# EAGLE design display (EAGLE 9.4.2)
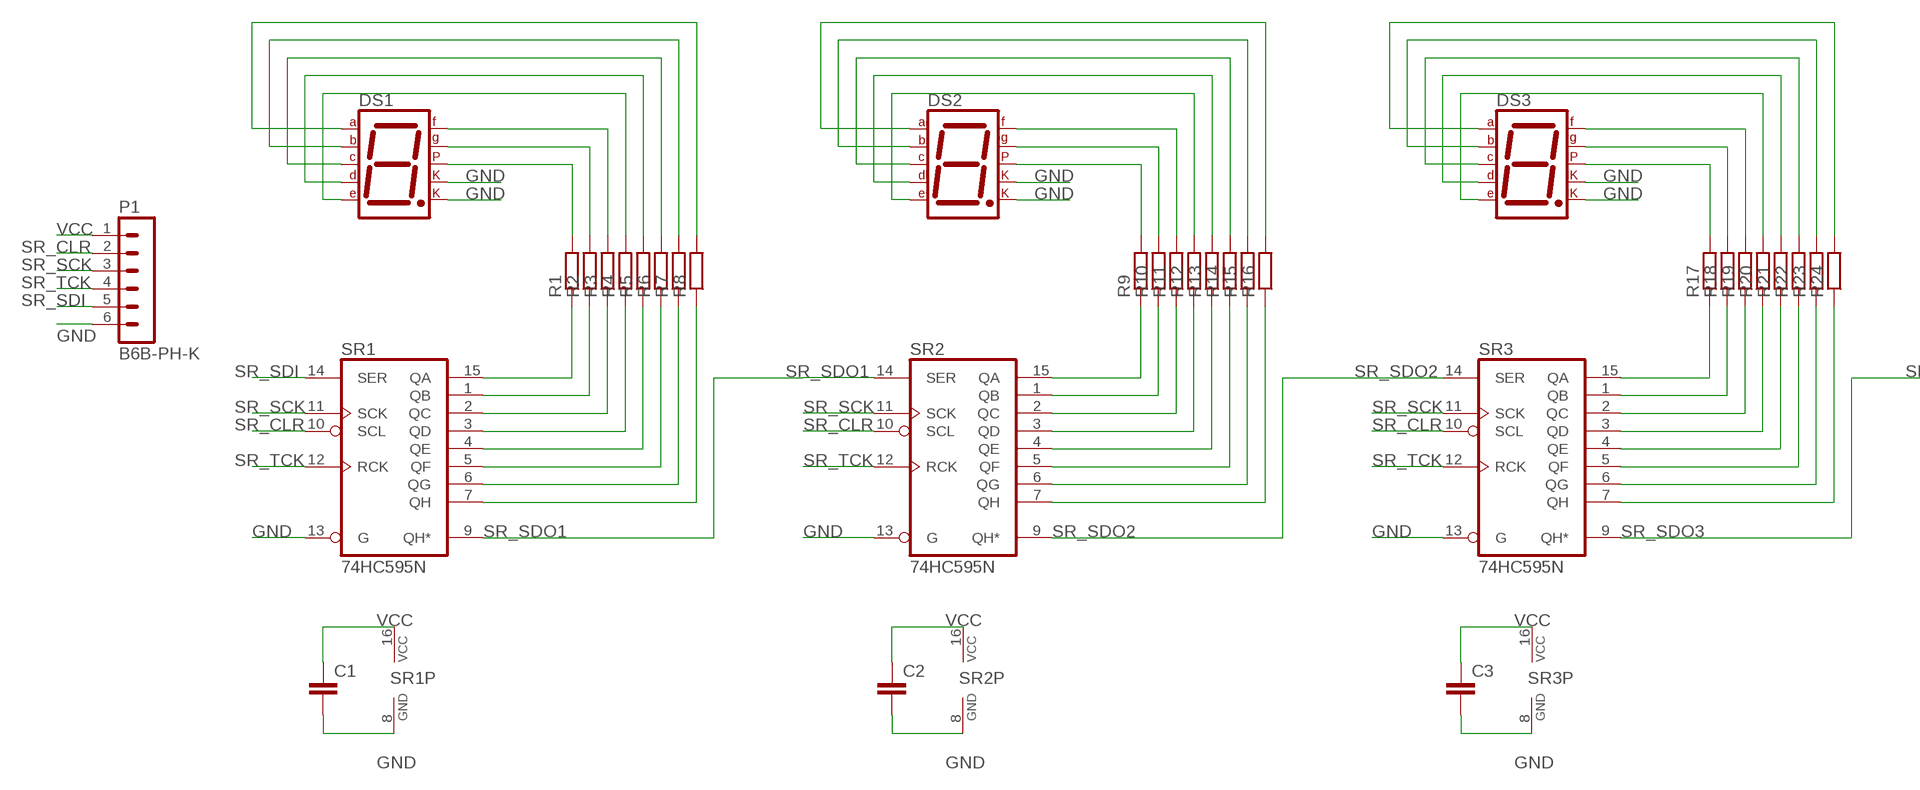
[diagram p0: schematic, sheet 1, part 1 of 2]
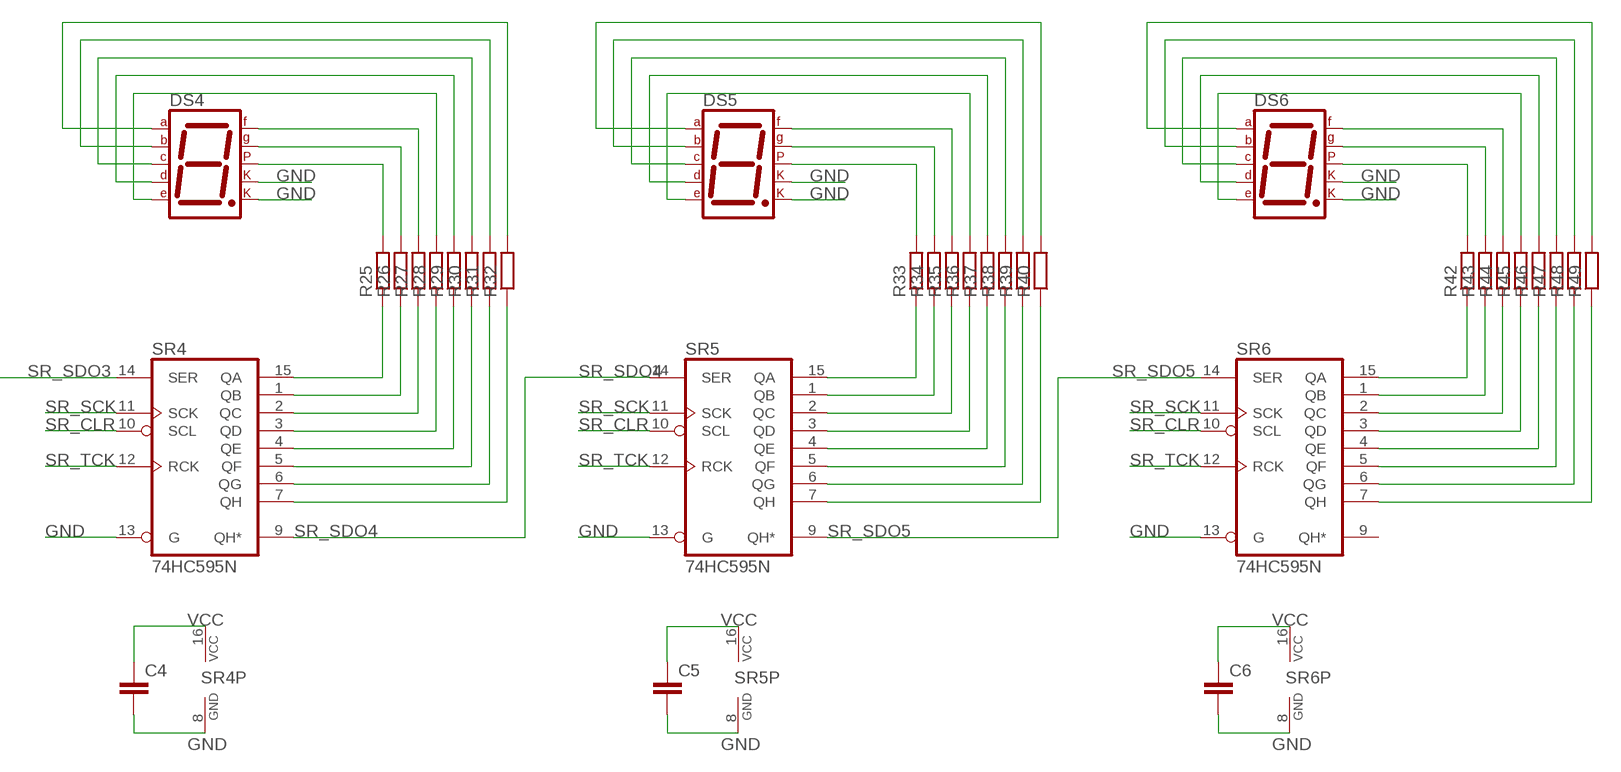
[diagram p1: schematic, sheet 1, part 2 of 2]

## Parts
C1  C-EU025-024X044  [C025-024X044]
C2  C-EU025-024X044  [C025-024X044]
C3  C-EU025-024X044  [C025-024X044]
C4  C-EU025-024X044  [C025-024X044]
C5  C-EU025-024X044  [C025-024X044]
C6  C-EU025-024X044  [C025-024X044]
DS1  7SEG-CK  [7SEG-13]
DS2  7SEG-CK  [7SEG-13]
DS3  7SEG-CK  [7SEG-13]
DS4  7SEG-CK  [7SEG-13]
DS5  7SEG-CK  [7SEG-13]
DS6  7SEG-CK  [7SEG-13]
P1  B6B-PH-K  [B6B-PH-K]
R1  R-EU_0207/10  [0207/10]
R2  R-EU_0207/10  [0207/10]
R3  R-EU_0207/10  [0207/10]
R4  R-EU_0207/10  [0207/10]
R5  R-EU_0207/10  [0207/10]
R6  R-EU_0207/10  [0207/10]
R7  R-EU_0207/10  [0207/10]
R8  R-EU_0207/10  [0207/10]
R9  R-EU_0207/10  [0207/10]
R10  R-EU_0207/10  [0207/10]
R11  R-EU_0207/10  [0207/10]
R12  R-EU_0207/10  [0207/10]
R13  R-EU_0207/10  [0207/10]
R14  R-EU_0207/10  [0207/10]
R15  R-EU_0207/10  [0207/10]
R16  R-EU_0207/10  [0207/10]
R17  R-EU_0207/10  [0207/10]
R18  R-EU_0207/10  [0207/10]
R19  R-EU_0207/10  [0207/10]
R20  R-EU_0207/10  [0207/10]
R21  R-EU_0207/10  [0207/10]
R22  R-EU_0207/10  [0207/10]
R23  R-EU_0207/10  [0207/10]
R24  R-EU_0207/10  [0207/10]
R25  R-EU_0207/10  [0207/10]
R26  R-EU_0207/10  [0207/10]
R27  R-EU_0207/10  [0207/10]
R28  R-EU_0207/10  [0207/10]
R29  R-EU_0207/10  [0207/10]
R30  R-EU_0207/10  [0207/10]
R31  R-EU_0207/10  [0207/10]
R32  R-EU_0207/10  [0207/10]
R33  R-EU_0207/10  [0207/10]
R34  R-EU_0207/10  [0207/10]
R35  R-EU_0207/10  [0207/10]
R36  R-EU_0207/10  [0207/10]
R37  R-EU_0207/10  [0207/10]
R38  R-EU_0207/10  [0207/10]
R39  R-EU_0207/10  [0207/10]
R40  R-EU_0207/10  [0207/10]
R42  R-EU_0207/10  [0207/10]
R43  R-EU_0207/10  [0207/10]
R44  R-EU_0207/10  [0207/10]
R45  R-EU_0207/10  [0207/10]
R46  R-EU_0207/10  [0207/10]
R47  R-EU_0207/10  [0207/10]
R48  R-EU_0207/10  [0207/10]
R49  R-EU_0207/10  [0207/10]
SR1  74HC595N  [DIL16]
SR2  74HC595N  [DIL16]
SR3  74HC595N  [DIL16]
SR4  74HC595N  [DIL16]
SR5  74HC595N  [DIL16]
SR6  74HC595N  [DIL16]

## Nets
GND: C1.2 C2.2 C3.2 C4.2 C5.2 C6.2 DS1.3(CK1) DS1.8(CK2) DS2.3(CK1) DS2.8(CK2) DS3.3(CK1) DS3.8(CK2) DS4.3(CK1) DS4.8(CK2) DS5.3(CK1) DS5.8(CK2) DS6.3(CK1) DS6.8(CK2) P1.6 SR1.8(GND) SR1.13(G) SR2.8(GND) SR2.13(G) SR3.8(GND) SR3.13(G) SR4.8(GND) SR4.13(G) SR5.8(GND) SR5.13(G) SR6.8(GND) SR6.13(G)
N$13: R1.1 SR1.15(QA)
N$14: R2.1 SR1.1(QB)
N$15: R3.1 SR1.2(QC)
N$16: R4.1 SR1.3(QD)
N$17: R5.1 SR1.4(QE)
N$18: R6.1 SR1.5(QF)
N$19: R7.1 SR1.6(QG)
N$20: R8.1 SR1.7(QH)
N$21: R9.1 SR2.15(QA)
N$22: R10.1 SR2.1(QB)
N$23: R11.1 SR2.2(QC)
N$24: R12.1 SR2.3(QD)
N$25: R13.1 SR2.4(QE)
N$26: R14.1 SR2.5(QF)
N$27: R15.1 SR2.6(QG)
N$28: R16.1 SR2.7(QH)
N$29: R17.1 SR3.15(QA)
N$30: R18.1 SR3.1(QB)
N$31: R19.1 SR3.2(QC)
N$32: R20.1 SR3.3(QD)
N$33: R21.1 SR3.4(QE)
N$34: R22.1 SR3.5(QF)
N$35: R23.1 SR3.6(QG)
N$36: R24.1 SR3.7(QH)
N$37: R25.1 SR4.15(QA)
N$38: R26.1 SR4.1(QB)
N$39: R27.1 SR4.2(QC)
N$40: R28.1 SR4.3(QD)
N$41: R29.1 SR4.4(QE)
N$42: R30.1 SR4.5(QF)
N$43: R31.1 SR4.6(QG)
N$44: R32.1 SR4.7(QH)
N$45: R33.1 SR5.15(QA)
N$46: R34.1 SR5.1(QB)
N$47: R35.1 SR5.2(QC)
N$48: R36.1 SR5.3(QD)
N$49: R37.1 SR5.4(QE)
N$50: R38.1 SR5.5(QF)
N$51: R39.1 SR5.6(QG)
N$52: R40.1 SR5.7(QH)
N$53: R42.1 SR6.15(QA)
N$54: R43.1 SR6.1(QB)
N$55: R44.1 SR6.2(QC)
N$56: R45.1 SR6.3(QD)
N$57: R46.1 SR6.4(QE)
N$58: R47.1 SR6.5(QF)
N$59: R48.1 SR6.6(QG)
N$60: R49.1 SR6.7(QH)
N$61: DS1.5(DP) R1.2
N$62: DS1.10(G) R2.2
N$63: DS1.9(F) R3.2
N$64: DS1.1(E) R4.2
N$65: DS1.2(D) R5.2
N$66: DS1.4(C) R6.2
N$67: DS1.6(B) R7.2
N$68: DS1.7(A) R8.2
N$69: DS2.5(DP) R9.2
N$70: DS2.10(G) R10.2
N$71: DS2.9(F) R11.2
N$72: DS2.1(E) R12.2
N$73: DS2.2(D) R13.2
N$74: DS2.4(C) R14.2
N$75: DS2.6(B) R15.2
N$76: DS2.7(A) R16.2
N$77: DS3.5(DP) R17.2
N$78: DS3.10(G) R18.2
N$79: DS3.9(F) R19.2
N$80: DS3.1(E) R20.2
N$81: DS3.2(D) R21.2
N$82: DS3.4(C) R22.2
N$83: DS3.6(B) R23.2
N$84: DS3.7(A) R24.2
N$85: DS4.5(DP) R25.2
N$86: DS4.10(G) R26.2
N$87: DS4.9(F) R27.2
N$88: DS4.1(E) R28.2
N$89: DS4.2(D) R29.2
N$90: DS4.4(C) R30.2
N$91: DS4.6(B) R31.2
N$92: DS4.7(A) R32.2
N$93: DS5.5(DP) R33.2
N$94: DS5.10(G) R34.2
N$95: DS5.9(F) R35.2
N$96: DS5.1(E) R36.2
N$97: DS5.2(D) R37.2
N$98: DS5.4(C) R38.2
N$99: DS5.6(B) R39.2
N$100: DS5.7(A) R40.2
N$101: DS6.5(DP) R42.2
N$102: DS6.10(G) R43.2
N$103: DS6.9(F) R44.2
N$104: DS6.1(E) R45.2
N$105: DS6.2(D) R46.2
N$106: DS6.4(C) R47.2
N$107: DS6.6(B) R48.2
N$108: DS6.7(A) R49.2
SR_CLR: P1.2 SR1.10(SCL) SR2.10(SCL) SR3.10(SCL) SR4.10(SCL) SR5.10(SCL) SR6.10(SCL)
SR_SCK: P1.3 SR1.11(SCK) SR2.11(SCK) SR3.11(SCK) SR4.11(SCK) SR5.11(SCK) SR6.11(SCK)
SR_SDI: P1.5 SR1.14(SER)
SR_SDO1: SR1.9(QH*) SR2.14(SER)
SR_SDO2: SR2.9(QH*) SR3.14(SER)
SR_SDO3: SR3.9(QH*) SR4.14(SER)
SR_SDO4: SR4.9(QH*) SR5.14(SER)
SR_SDO5: SR5.9(QH*) SR6.14(SER)
SR_TCK: P1.4 SR1.12(RCK) SR2.12(RCK) SR3.12(RCK) SR4.12(RCK) SR5.12(RCK) SR6.12(RCK)
VCC: C1.1 C2.1 C3.1 C4.1 C5.1 C6.1 P1.1 SR1.16(VCC) SR2.16(VCC) SR3.16(VCC) SR4.16(VCC) SR5.16(VCC) SR6.16(VCC)
Unconnected: SR6.9(QH*)

## Library data of the parts
C1-C6 = rcl:C-EU: CAPACITOR, European symbol; SPICEPREFIX: C
DS1-DS6 = special:7SEG-CK: 7-segment DISPLAY single cathode, 13 mm
P1 = con-jst-ph:B6B-PH-K: HEADER
R1-R40 R42-R49 = rcl:R-EU_: RESISTOR, European symbol; SPICEPREFIX: R
SR1-SR6 = 74xx-eu:74*595: 8-bit SHIFT REGISTER, output latch

## Board
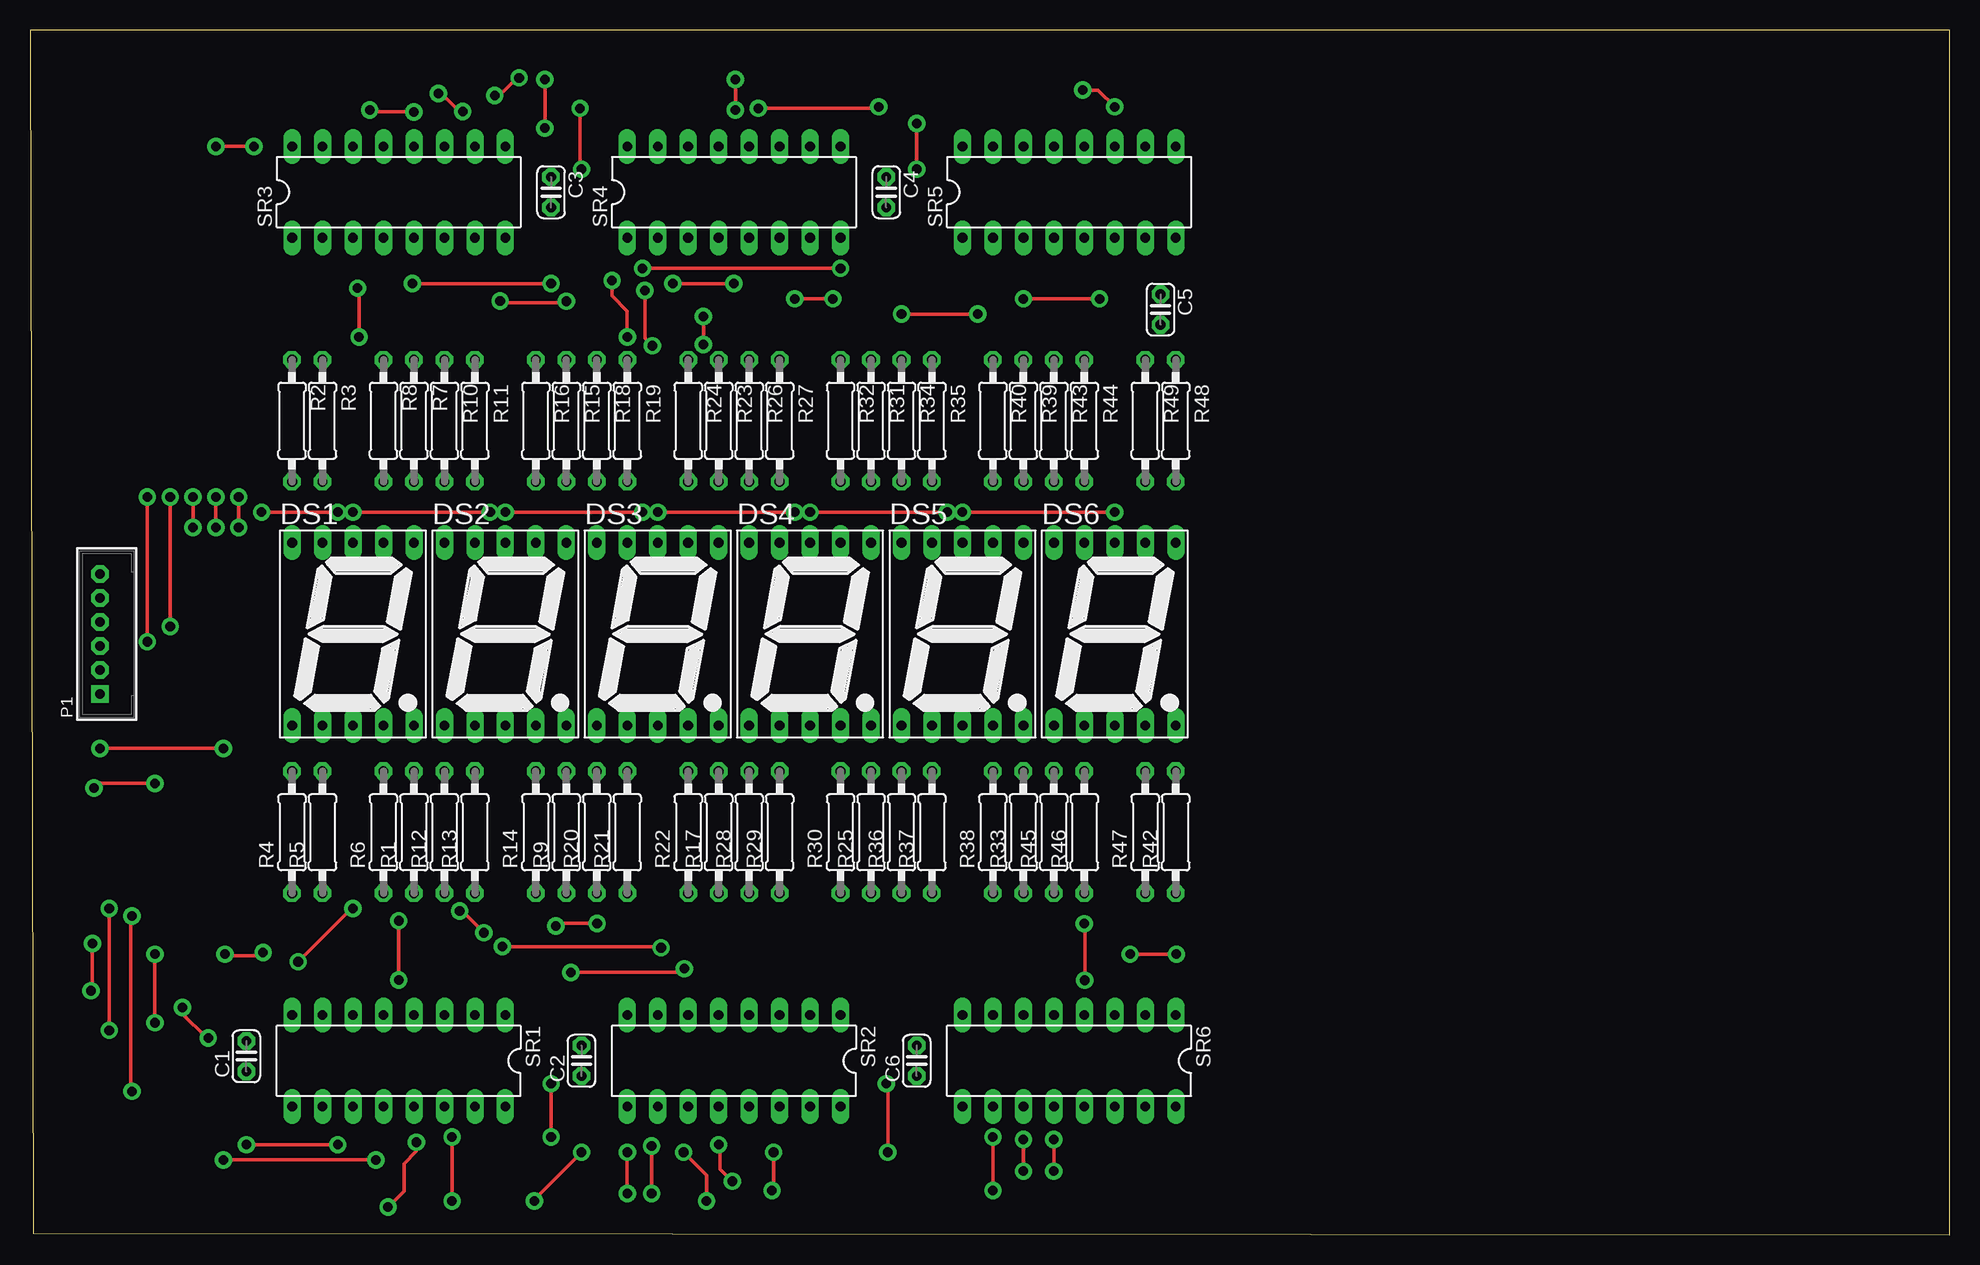
[diagram p2: board, top side]
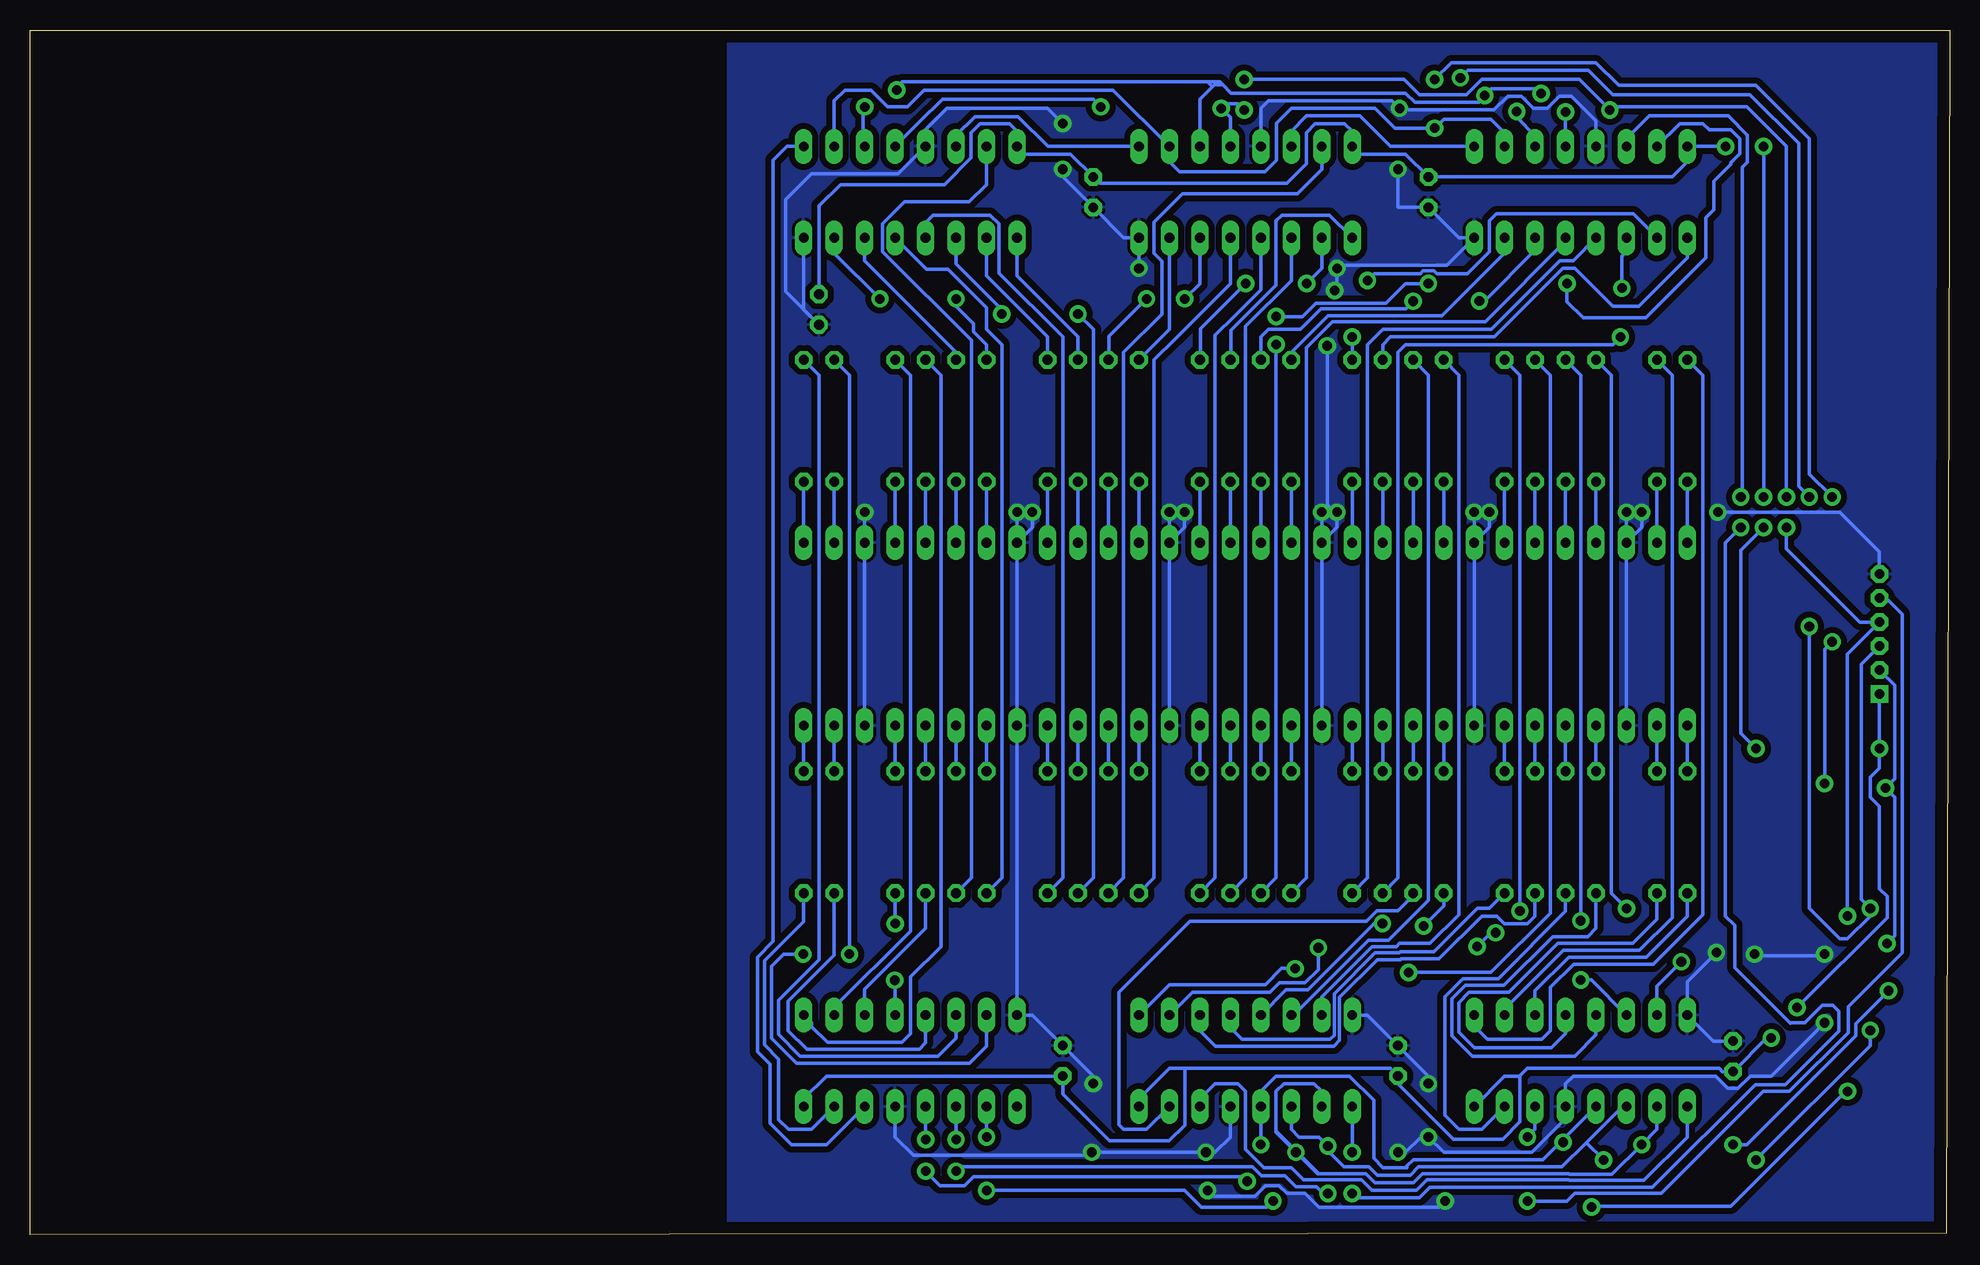
[diagram p3: board, bottom side, seen from below]

Size 160 x 100.38 mm. Coordinates in mm from the lower left corner, seen from the top.
Outline: 0.25,0.13 160,0 160,100.38 0,100.38 0.25,0.13
Copper layers (1*16): Top 0.035mm / dielectric 1.5mm / Bottom 0.035mm
Design rules "default *": minimum track width 6mil, minimum drill 0.65mm, track to track 0.15mm, track to pad 6mil, pad to pad 6mil, via to via 6mil, smd to smd 6mil, copper to edge 40mil, drill to drill 6mil, minimum pad ring 10mil, minimum via ring 8mil, stop-mask expansion 4mil, vias tented up to drill 0mil, thermal gap 10mil

### Footprints (pad centres in the part's own frame; a part is rotated, then mirrored left to right if it is on the bottom)
C025-024X044 = drill 0.813 octagon: 1 -1.27,0; 2 1.27,0
7SEG-13 = drill 0.813 long: 1 -5.08,-7.62; 2 -2.54,-7.62; 3 0,-7.62; 4 2.54,-7.62; 5 5.08,-7.62; 6 5.08,7.62; 7 2.54,7.62; 8 0,7.62; 9 -2.54,7.62; 10 -5.08,7.62
B6B-PH-K = drill 0.813 square: 1 -5,0 | drill 0.813 octagon: 2 -3,0; 3 -1,0; 4 1,0; 5 3,0; 6 5,0
0207/10 = drill 0.813 octagon: 1 -5.08,0; 2 5.08,0
DIL16 = drill 0.813 long: 1 -8.89,-3.81; 2 -6.35,-3.81; 3 -3.81,-3.81; 4 -1.27,-3.81; 5 1.27,-3.81; 6 3.81,-3.81; 7 6.35,-3.81; 8 8.89,-3.81; 9 8.89,3.81; 10 6.35,3.81; 11 3.81,3.81; 12 1.27,3.81; 13 -1.27,3.81; 14 -3.81,3.81; 15 -6.35,3.81; 16 -8.89,3.81

### Placement (x,y rotation side)
C1  18.03,14.86 90 top
C2  45.97,14.48 90 top
C3  43.43,86.87 270 top
C4  71.37,86.87 270 top
C5  94.23,77.09 270 top
C6  73.91,14.48 90 top
DS1  26.92,50.04 0 top
DS2  39.62,50.04 0 top
DS3  52.32,50.04 0 top
DS4  65.02,50.04 0 top
DS5  77.72,50.04 0 top
DS6  90.42,50.04 0 top
P1  5.84,50.04 90 top
R1  32,33.53 90 top
R2  21.84,67.82 270 top
R3  24.38,67.82 270 top
R4  21.84,33.53 90 top
R5  24.38,33.53 90 top
R6  29.46,33.53 90 top
R7  32,67.82 270 top
R8  29.46,67.82 270 top
R9  44.7,33.53 90 top
R10  34.54,67.82 270 top
R11  37.08,67.82 270 top
R12  34.54,33.53 90 top
R13  37.08,33.53 90 top
R14  42.16,33.53 90 top
R15  44.7,67.82 270 top
R16  42.16,67.82 270 top
R17  57.4,33.53 90 top
R18  47.24,67.82 270 top
R19  49.78,67.82 270 top
R20  47.24,33.53 90 top
R21  49.78,33.53 90 top
R22  54.86,33.53 90 top
R23  57.4,67.82 270 top
R24  54.86,67.82 270 top
R25  70.1,33.53 90 top
R26  59.94,67.82 270 top
R27  62.48,67.82 270 top
R28  59.94,33.53 90 top
R29  62.48,33.53 90 top
R30  67.56,33.53 90 top
R31  70.1,67.82 270 top
R32  67.56,67.82 270 top
R33  82.8,33.53 90 top
R34  72.64,67.82 270 top
R35  75.18,67.82 270 top
R36  72.64,33.53 90 top
R37  75.18,33.53 90 top
R38  80.26,33.53 90 top
R39  82.8,67.82 270 top
R40  80.26,67.82 270 top
R42  95.5,33.53 90 top
R43  85.34,67.82 270 top
R44  87.88,67.82 270 top
R45  85.34,33.53 90 top
R46  87.88,33.53 90 top
R47  92.96,33.53 90 top
R48  95.5,67.82 270 top
R49  92.96,67.82 270 top
SR1  30.73,14.48 180 top
SR2  58.67,14.48 180 top
SR3  30.73,86.87 0 top
SR4  58.67,86.87 0 top
SR5  86.61,86.87 0 top
SR6  86.61,14.48 180 top

### Tracks (layer width: path | path; a pad name or v marks a point on that pad's centre or on a via)
GND  (via drill 0.8)
  Top 0.3: v19.3,60.2 v25.65,60.2 | v26.92,60.2 v38.35,60.2 | v39.62,60.2 v51.05,60.2 | v52.32,60.2 v63.75,60.2 | v65.02,60.2 v76.45,60.2 | v77.72,60.2 v90.42,60.2 | v43.43,12.57 v43.43,8.13 | v71.37,12.57 71.5,12.45 v71.5,6.86 | v45.97,88.77 45.85,88.9 v45.85,93.85 | v73.91,88.77 v73.91,92.58 | v61.98,6.86 61.98,3.81 v61.85,3.68 | v42.04,2.79 42.04,2.92 v45.97,6.86 | v10.41,17.65 v10.41,23.37 | v19.43,23.5 19.18,23.24 16.38,23.24 v16.26,23.37 | v51.05,80.52 v67.56,80.52 | v51.26,78.68 51.26,74.68 v51.87,74.07
  Bottom 0.3: DS6.3 DS6.8 v90.42,60.2 | DS5.8 DS5.3 SR6.8 76.45,18.29 C6.2 71.37,13.21 v71.37,12.57 | DS4.8 DS4.3 | DS3.8 DS3.3 | DS2.8 DS2.3 | DS1.8 DS1.3 | P1.6 5.84,56.9 9.14,60.2 v19.3,60.2 | DS1.8 25.65,58.93 v25.65,60.2 v26.92,60.2 DS1.8 | DS2.8 38.35,58.93 v38.35,60.2 v39.62,60.2 DS2.8 | DS3.8 51.05,58.93 v51.05,60.2 51.26,60.2 | DS3.8 v52.32,60.2 51.26,60.2 | DS4.8 63.75,58.93 v63.75,60.2 v65.02,60.2 DS4.8 | DS5.8 76.45,58.93 v76.45,60.2 v77.72,60.2 DS5.8 | C1.2 19.68,16.13 SR1.8 21.84,21.08 v19.43,23.5 | SR2.8 48.51,18.29 C2.2 43.43,13.21 v43.43,12.57 | SR5.8 95.5,77.09 C5.2 97.03,78.61 97.03,86.23 94.87,88.39 87.63,88.39 SR5.13 85.34,92.08 83.57,93.85 75.18,93.85 v73.91,92.58 | SR2.13 59.94,8.13 61.21,6.86 v61.98,6.86 v71.5,6.86 71.75,6.6 86.36,6.6 87.88,8.13 SR6.13 | v45.97,88.77 45.97,85.6 C3.2 40.89,83.06 SR3.8 41.92,80.77 50.81,80.77 v51.05,80.52 51.05,78.89 v51.26,78.68 | SR4.13 57.4,93.85 56.77,94.49 46.48,94.49 v45.85,93.85 45.72,93.73 37.97,93.73 36.83,94.87 35.69,94.87 34.67,93.85 33.53,93.85 32.51,94.87 31.51,94.87 29.46,92.82 SR3.13 | v73.91,88.77 73.91,88.14 C4.2 68.83,83.06 SR4.8 v67.56,80.52 | v61.85,3.68 61.34,3.17 57.91,3.17 57.02,4.06 55.88,4.06 55.24,3.43 53.72,3.43 52.58,2.29 42.55,2.29 v42.04,2.79 | v45.97,6.86 45.34,6.86 44.07,8.13 v43.43,8.13 42.16,6.86 34.8,6.86 32,9.65 SR1.13 32,12.57 31.37,13.21 19.5,13.21 18.46,12.17 17.65,12.17 16.62,13.21 14.86,13.21 v10.41,17.65 | v10.41,23.37 10.54,23.24 16.13,23.24 v16.26,23.37 | v51.87,74.07 51.87,60.81 51.26,60.2
  pour Bottom (isolate 0.5): 0.13,100.33 0.13,0.25 101.85,0.25 101.85,100.33
N$13
  Bottom 0.3: R1.1 32,26.93 37.6,21.33 40.55,21.33 42.07,19.82 42.07,9.94 40.89,8.76 38.99,8.76 SR1.15
N$14
  Bottom 0.3: R2.1 20.57,71.63 20.57,26.67 24.71,22.54 31.31,22.54 33.26,20.59 33.26,17 33.99,16.27 38.53,16.27 39.62,17.36 SR1.1
N$15
  Bottom 0.3: R3.1 23.11,71.63 23.11,26.42 25.84,23.69 32.19,23.69 37.08,18.8 SR1.2
N$16
  Bottom 0.3: R4.1 21.84,26.54 25.27,23.11 31.75,23.11 34.54,20.32 SR1.3
N$17
  Bottom 0.3: SR1.4 32,16.73 33.17,15.56 39.6,15.56 40.91,16.87 40.91,19.32 40.05,20.18 36.72,20.18 32.64,24.26 26.42,24.26 24.38,26.29 R5.1
N$18
  Bottom 0.3: R6.1 29.46,25.53 30.16,24.83 33.08,24.83 37.16,20.76 40.37,20.76 41.49,19.63 41.49,16.56 39.79,14.86 31.24,14.86 29.46,16.64 SR1.5
N$19  (via drill 0.8)
  Top 0.3: v30.73,21.22 v30.73,26.16
  Bottom 0.3: R7.1 30.73,71.63 v30.73,26.16 | SR1.6 29.85,21.22 v30.73,21.22
N$20  (via drill 0.8)
  Top 0.3: v26.92,27.18 26.8,27.18 v22.35,22.73
  Bottom 0.3: R8.1 28.19,71.63 28.19,28.45 v26.92,27.18 | SR1.7 24.38,20.7 v22.35,22.73
N$21
  Bottom 0.3: R9.1 44.7,28.26 45.97,27 47.71,27 48.59,26.12 63.31,26.12 69.23,20.19 69.23,9.16 68.83,8.76 66.93,8.76 SR2.15
N$22  (via drill 0.8)
  Top 0.3: v54.54,22.16 54.23,21.85 v45.09,21.85
  Bottom 0.3: R10.1 33.27,71.63 33.27,26.8 38.22,21.85 v45.09,21.85 | SR2.1 65.02,20.83 57.03,20.83 55.68,22.18 54.56,22.18 v54.54,22.16
N$23  (via drill 0.8)
  Top 0.3: v52.6,23.9 52.51,24 v39.37,24 | v37.84,25.15 36.02,26.98 v35.81,26.98
  Bottom 0.3: R11.1 35.81,71.63 v35.81,26.98 | SR2.2 63.12,20.19 56.64,20.19 55.87,20.97 53.72,20.97 52.6,22.08 v52.6,23.9 | v39.37,24 38.22,25.15 v37.84,25.15
N$24
  Bottom 0.3: SR2.3 62.48,16.98 61.19,15.69 51.33,15.69 50.84,16.18 50.84,19.77 47.69,22.92 45.79,22.92 45.73,22.98 42.55,22.98 38.99,26.54 37.72,26.54 37.08,25.91 35.18,25.91 34.54,26.54 R12.1
N$25
  Bottom 0.3: SR2.4 59.94,17.24 58.98,16.27 51.64,16.27 51.29,16.62 51.29,20.08 47.88,23.5 45.85,23.5 45.79,23.55 42.99,23.55 39.37,27.18 38.35,27.18 R13.1
N$26  (via drill 0.8)
  Top 0.3: v47.27,25.93 43.84,25.93 v43.84,25.71
  Bottom 0.3: v47.27,25.93 47.92,25.93 53.47,20.39 55.3,20.39 SR2.5 | v43.84,25.71 42.16,27.38 R14.1
N$27
  Bottom 0.3: R15.1 43.43,71.63 43.43,27.88 46.77,24.54 48.42,24.54 54.68,18.29 SR2.6
N$28
  Bottom 0.3: R16.1 40.89,71.63 40.89,26.67 43.31,24.26 45.85,24.26 46.1,24 48.13,24 52.32,19.81 SR2.7
N$29  (via drill 0.8)
  Top 0.3: v56.13,74.17 v56.13,76.5 | v43.43,79.25 v31.88,79.25
  Bottom 0.3: R17.1 56.13,29.72 v56.13,74.17 | v56.13,76.5 53.93,76.5 52.82,77.62 46.97,77.62 45.34,79.25 v43.43,79.25 | v31.88,79.25 31.88,77.72 30.54,76.39 25.31,76.39 20.3,81.39 20.3,84.73 19.63,85.39 19.63,87.78 18.23,89.19 18.23,89.31 17.48,90.06 17.48,91.3 18.23,92.05 20.04,92.05 20.57,92.58 22.48,92.58 SR3.15
N$30
  Bottom 0.3: SR3.1 21.84,81.41 25.91,77.34 28.07,77.34 31.24,80.52 32.22,80.52 37.93,74.81 42.67,74.81 42.67,74.8 46.61,74.8 47.24,74.17 R18.1
N$31  (via drill 0.8)
  Top 0.3: v48.51,79.5 48.51,78.22 49.78,76.95 v49.78,74.8
  Bottom 0.3: SR3.2 24.38,83.09 26.37,85.08 37.77,85.08 38.37,84.47 38.37,81.9 40.21,80.07 42.74,80.07 42.99,80.31 43.88,80.31 44.12,80.07 47.94,80.07 v48.51,79.5 | v49.78,74.8 R19.1
N$32  (via drill 0.8)
  Top 0.3: v27.3,78.87 27.43,78.74 v27.43,74.8
  Bottom 0.3: R20.1 45.97,29.72 45.97,73.53 45.34,74.17 28.07,74.17 v27.43,74.8 | SR3.3 26.92,81.92 27.3,81.53 v27.3,78.87
N$33
  Bottom 0.3: R21.1 48.51,29.72 48.51,74.17 47.24,75.44 38.19,75.44 32.48,81.15 31.37,81.15 SR3.4
N$34
  Bottom 0.3: R22.1 53.59,29.72 53.59,73.91 51.43,76.07 43.31,76.07 43.29,76.09 38.69,76.09 32,82.77 SR3.5
N$35  (via drill 0.8)
  Top 0.3: v39.19,77.8 39.31,77.67 44.6,77.67 v44.7,77.78
  Bottom 0.3: R23.1 57.4,74.8 56.77,75.44 54.1,75.44 52.38,77.17 45.31,77.17 v44.7,77.78 | v39.19,77.8 38.79,77.8 34.54,82.04 SR3.6
N$36
  Bottom 0.3: SR3.7 37.08,81.79 37.27,81.6 42.29,76.58 51.82,76.58 54.86,73.53 R24.1
N$37
  Bottom 0.3: R25.1 68.83,29.72 68.83,73.53 65.66,76.71 65.66,81.12 66.31,81.77 66.31,84.34 63.93,86.73 62.62,86.73 62.61,86.74 54.36,86.74 52.32,88.77 SR4.15
N$38
  Bottom 0.3: R26.1 59.89,72.96 59.89,75.37 56.15,79.1 56.15,84.47 55.66,84.96 51.69,84.96 SR4.1
N$39  (via drill 0.8)
  Top 0.3: v58.67,79.25 v53.59,79.25
  Bottom 0.3: R27.1 62.48,72.94 62.44,72.99 62.44,75.48 v58.67,79.25 | v53.59,79.25 52.32,80.52 SR4.2
N$40
  Bottom 0.3: R28.1 58.67,29.72 58.67,75.69 54.86,79.5 SR4.3
N$41
  Bottom 0.3: R29.1 61.21,29.72 61.21,74.93 59.57,76.57 57.4,78.74 SR4.4
N$42
  Bottom 0.3: R30.1 66.29,29.72 66.29,72.9 64.54,74.65 64.54,74.66 59.94,79.25 SR4.5
N$43  (via drill 0.8)
  Top 0.3: v66.93,77.98 v63.75,77.98
  Bottom 0.3: R31.1 70.05,72.96 70.05,74.86 v66.93,77.98 | v63.75,77.98 62.48,79.25 SR4.6
N$44
  Bottom 0.3: R32.1 65.02,75.44 SR4.7
N$45
  Bottom 0.3: R33.1 81.53,29.72 81.53,74.51 88.92,81.9 88.92,84.22 87.09,86.05 81.72,86.05 80.26,87.5 SR5.15
N$46
  Bottom 0.3: SR5.1 77.72,79.88 72.64,74.8 R34.1
N$47
  Bottom 0.3: SR5.2 80.26,79.88 75.18,74.8 R35.1
N$48  (via drill 0.8)
  Top 0.3: v78.99,76.71 v72.64,76.71
  Bottom 0.3: R36.1 71.37,29.72 71.37,75.44 v72.64,76.71 | SR5.3 82.8,80.9 78.99,77.09 v78.99,76.71
N$49
  Bottom 0.3: R37.1 73.91,29.72 73.91,74.8 79.23,80.12 79.23,84.22 79.97,84.96 84.71,84.96 85.34,84.33 SR5.4
N$50
  Bottom 0.3: R38.1 78.99,29.72 78.99,74.17 80.26,75.44 80.26,77.22 83.48,80.43 85.26,80.43 SR5.5
N$51
  Bottom 0.3: R39.1 82.8,73.53 90.42,81.15 SR5.6
N$52  (via drill 0.8)
  Top 0.3: v89.15,77.98 v82.8,77.98
  Bottom 0.3: SR5.7 92.96,81.79 v89.15,77.98 | R40.1 80.26,74.17 81.35,75.25 81.35,75.89 82.8,77.34 v82.8,77.98
N$53
  Bottom 0.3: R42.1 95.5,26.07 97.21,24.36 97.21,24.37 98.78,22.8 98.78,15.81 97.59,14.62 97.59,9.58 96.77,8.76 94.87,8.76 SR6.15
N$54
  Bottom 0.3: R43.1 84.07,71.63 84.07,24 86.6,21.48 86.6,16.75 87.33,16.02 93.52,16.02 94.83,17.33 94.87,17.65 SR6.1
N$55
  Bottom 0.3: R44.1 86.61,71.63 86.61,25.27 92.96,18.92 SR6.2
N$56
  Bottom 0.3: SR6.3 90.42,20.45 85.34,25.53 R45.1
N$57  (via drill 0.8)
  Top 0.3: v87.92,21.19 87.92,25.88 v87.88,25.91
  Bottom 0.3: SR6.4 87.88,21.16 v87.92,21.19 | v87.88,25.91 R46.1
N$58
  Bottom 0.3: SR6.5 85.34,15.97 85.87,15.44 95.23,15.44 96.79,17 96.79,19.45 92.96,23.28 R47.1
N$59
  Bottom 0.3: R48.1 94.23,71.63 94.23,22.9 97.62,19.51 97.62,16.69 95.8,14.86 84.29,14.86 82.8,16.35 SR6.6
N$60  (via drill 0.8)
  Top 0.3: v95.56,23.37 v91.69,23.37
  Bottom 0.3: R49.1 91.69,71.63 v91.69,23.37 | SR6.7 80.26,15.71 81.69,14.28 96.11,14.28 98.2,16.37 98.2,22.36 97.19,23.37 v95.56,23.37
N$61
  Bottom 0.3: R1.2 DS1.5
N$62
  Bottom 0.3: R2.2 DS1.10
N$63
  Bottom 0.3: R3.2 DS1.9
N$64
  Bottom 0.3: R4.2 DS1.1
N$65
  Bottom 0.3: R5.2 DS1.2
N$66
  Bottom 0.3: R6.2 DS1.4
N$67
  Bottom 0.3: R7.2 DS1.6
N$68
  Bottom 0.3: R8.2 DS1.7
N$69
  Bottom 0.3: R9.2 DS2.5
N$70
  Bottom 0.3: R10.2 DS2.10
N$71
  Bottom 0.3: R11.2 DS2.9
N$72
  Bottom 0.3: R12.2 DS2.1
N$73
  Bottom 0.3: R13.2 DS2.2
N$74
  Bottom 0.3: R14.2 DS2.4
N$75
  Bottom 0.3: R15.2 DS2.6
N$76
  Bottom 0.3: R16.2 DS2.7
N$77
  Bottom 0.3: R17.2 DS3.5
N$78
  Bottom 0.3: R18.2 DS3.10
N$79
  Bottom 0.3: R19.2 DS3.9
N$80
  Bottom 0.3: R20.2 DS3.1
N$81
  Bottom 0.3: R21.2 DS3.2
N$82
  Bottom 0.3: R22.2 DS3.4
N$83
  Bottom 0.3: R23.2 DS3.6
N$84
  Bottom 0.3: R24.2 DS3.7
N$85
  Bottom 0.3: R25.2 DS4.5
N$86
  Bottom 0.3: R26.2 DS4.10
N$87
  Bottom 0.3: R27.2 DS4.9
N$88
  Bottom 0.3: R28.2 DS4.1
N$89
  Bottom 0.3: R29.2 DS4.2
N$90
  Bottom 0.3: R30.2 DS4.4
N$91
  Bottom 0.3: R31.2 DS4.6
N$92
  Bottom 0.3: R32.2 DS4.7
N$93
  Bottom 0.3: R33.2 DS5.5
N$94
  Bottom 0.3: R34.2 DS5.10
N$95
  Bottom 0.3: R35.2 DS5.9
N$96
  Bottom 0.3: R36.2 DS5.1
N$97
  Bottom 0.3: R37.2 DS5.2
N$98
  Bottom 0.3: R38.2 DS5.4
N$99
  Bottom 0.3: R39.2 DS5.6
N$100
  Bottom 0.3: R40.2 DS5.7
N$101
  Bottom 0.3: R42.2 DS6.5
N$102
  Bottom 0.3: R43.2 DS6.10
N$103
  Bottom 0.3: R44.2 DS6.9
N$104
  Bottom 0.3: R45.2 DS6.1
N$105
  Bottom 0.3: R46.2 DS6.2
N$106
  Bottom 0.3: R47.2 DS6.4
N$107
  Bottom 0.3: R48.2 DS6.6
N$108
  Bottom 0.3: R49.2 DS6.7
SR_CLR  (via drill 0.8)
  Top 0.3: v25.65,7.49 v18.03,7.49 | v5.21,24.26 5.21,20.45 v5.08,20.32 | v80.26,3.68 v80.26,8.13 | v42.93,96.27 v42.93,92.2 | v9.78,61.47 v9.78,49.4 | v10.41,37.59 5.71,37.59 v5.33,37.21 | v54.48,6.86 56.39,4.95 v56.39,2.79
  Bottom 0.3: SR3.10 37.08,91.82 38.23,92.96 42.16,92.96 v42.93,92.2 46.23,92.2 47.88,93.85 54.86,93.85 56.12,92.6 56.12,89.52 57.05,88.59 64.2,88.59 65.02,89.41 SR4.10 69.72,95.38 85.47,95.38 86.87,93.98 88.52,93.98 89.92,95.38 92.08,95.38 92.96,94.49 SR5.10 | SR1.10 24.38,8.76 v25.65,7.49 28.13,5.02 31.69,5.02 31.75,5.08 43.94,5.08 44.7,4.32 47.88,4.32 48.64,5.08 52.58,5.08 | 52.58,5.08 56.13,8.64 | 56.13,8.64 56.13,11.94 55.5,12.57 52.96,12.57 52.32,11.94 SR2.10 | v5.21,24.26 4.57,24.89 4.57,36.45 v5.33,37.21 4.57,37.97 4.57,45.77 P1.2 | v18.03,7.49 16.9,7.49 7.81,16.58 7.81,17.59 v5.08,20.32 | v56.39,2.79 56.9,2.29 62.36,2.29 63.75,3.68 v80.26,3.68 | v80.26,8.13 SR6.10 | v42.93,96.27 41.53,97.66 29.46,97.66 27.56,95.76 16.13,95.76 11.68,91.31 11.68,63.37 v9.78,61.47 | v9.78,49.4 10.41,48.77 v10.41,37.59 | 56.13,8.64 56.13,8.51 v54.48,6.86 52.7,5.08 52.58,5.08
SR_SCK  (via drill 0.8)
  Top 0.3: v36.07,93.6 35.79,93.6 34.29,95.1 v34.04,95.1 | v90.42,93.98 89.03,95.38 v87.76,95.38 | v28.83,6.22 v16.13,6.22 | v6.6,17.02 v6.6,27.18 | v51.81,7.37 51.81,3.44 v51.82,3.43 | v82.8,5.28 v82.8,7.92 | v40.77,96.39 40.59,96.39 39.12,94.92 v38.73,94.92 | v11.68,61.47 v11.68,50.67
  Bottom 0.3: SR3.11 34.54,91.57 36.07,93.09 v36.07,93.6 | v34.04,95.1 34.42,95.48 38.18,95.48 v38.73,94.92 38.73,94.87 39.24,94.36 44.58,94.36 45.34,95.12 59.88,95.12 60.58,95.82 | 60.58,95.82 61.28,95.82 | 61.02,96.08 61.28,95.82 | 61.28,95.82 61.47,95.63 | 61.47,95.63 62.48,94.61 SR4.11 | v87.76,95.38 87.76,95.63 87.31,96.08 61.85,96.08 | 61.85,96.08 61.02,96.08 | v90.42,93.98 90.55,93.85 90.55,90.81 SR5.11 | SR1.11 27.27,10.67 30.27,7.67 | SR2.11 54.86,8.76 54.23,8.13 52.56,8.13 v51.81,7.37 51.81,6.99 50.46,5.65 48.39,5.65 47.69,4.95 44.96,4.95 44.28,5.63 32.3,5.63 30.27,7.67 | 30.27,7.67 v28.83,6.22 | v16.13,6.22 6.6,15.75 v6.6,17.02 | P1.3 7.37,47.51 7.37,27.94 v6.6,27.18 6.6,26.54 8.51,24.64 9.14,24.64 11.68,27.18 v11.68,50.67 | v51.82,3.43 52.2,3.43 52.76,4 54.48,4 55.38,4.89 57.34,4.89 58.12,5.66 82.42,5.66 v82.8,5.28 | v82.8,7.92 SR6.11 | v11.68,61.47 12.57,62.36 12.57,90.93 16.64,95 28.07,95 30.1,97.03 40.13,97.03 v40.77,96.39 | 61.02,96.08 60.83,96.08 60.58,95.82 | 61.47,95.63 61.47,95.69 61.85,96.08
SR_SDI  (via drill 0.8)
  Top 0.3: v35.18,8.13 v35.18,2.79
  Bottom 0.3: SR1.14 34.54,8.76 v35.18,8.13 | v35.18,2.79 31.88,2.79 31.24,3.43 24,3.43 15.51,11.93 13.36,11.93 8.45,16.83 8.45,18.98 3.94,23.5 3.94,51.69 5.29,53.04 P1.5
SR_SDO1
  Bottom 0.3: SR1.9 21.84,8.13 25.46,4.51 31.69,4.51 31.74,4.57 43.56,4.57 44.45,3.68 48.13,3.68 49.02,4.57 53.85,4.57 54.86,5.59 57.15,5.59 58.67,7.11 58.67,11.94 59.31,12.57 61.21,12.57 62.48,11.3 SR2.14
SR_SDO2  (via drill 0.8)
  Top 0.3: v49.78,6.86 v49.78,3.43 | v17.4,58.93 v17.4,61.47
  Bottom 0.3: SR2.9 v49.78,6.86 | v49.78,3.43 49.4,3.05 44.2,3.05 43.31,3.94 24.77,3.94 16.2,12.5 13.67,12.5 9.22,16.96 9.22,18.6 9.72,19.1 10.6,19.1 12.06,17.65 13.21,17.65 13.27,17.59 17.91,22.23 17.91,25.78 18.67,26.54 18.67,57.66 v17.4,58.93 | SR3.14 26.92,91.31 25.02,93.22 18.45,93.22 16.85,91.61 16.85,89.36 17.27,88.94 17.27,61.59 v17.4,61.47
SR_SDO3
  Bottom 0.3: SR3.9 46.61,90.68 49.15,93.22 53.59,93.22 54.86,91.95 SR4.14
SR_SDO4
  Bottom 0.3: SR4.9 75.15,90.68 77.63,93.16 81.25,93.16 82.8,91.6 SR5.14
SR_SDO5
  Bottom 0.3: SR6.14 93.6,7.49 96.52,7.49 98.3,9.27 98.3,14.18 99.35,15.24 99.35,23.11 98.04,24.42 98.04,89.53 96.9,90.68 SR5.9
SR_TCK  (via drill 0.8)
  Top 0.3: v70.74,93.98 70.61,93.85 v60.71,93.85 | v32.2,7.69 32.2,6.93 31.19,5.91 31.19,3.63 v29.84,2.29 | v8.51,11.94 8.38,12.06 8.38,26.42 v8.51,26.54 | v57.4,7.49 57.53,7.37 57.53,5.46 v58.55,4.45 | v85.34,5.28 v85.34,7.92 | v32,93.55 28.5,93.55 v28.32,93.73 | v13.59,61.47 v13.59,58.93 | v58.8,96.27 v58.8,93.73
  Bottom 0.3: SR5.12 85.79,92.77 83.95,94.61 71.37,94.61 v70.74,93.98 | SR4.12 59.94,93.09 v60.71,93.85 60.33,94.23 59.31,94.23 v58.8,93.73 | SR1.12 31.55,8.58 32,8.13 | 32,8.13 33.91,6.22 44.7,6.22 45.21,5.71 45.21,5.59 47.24,5.59 48,6.34 48,11.18 50.02,13.21 56.13,13.21 57.4,11.94 SR2.12 v57.4,7.49 | 32,8.13 32,7.89 v32.2,7.69 | v8.51,11.94 8.65,11.94 18.24,2.34 29.79,2.34 v29.84,2.29 | v8.51,26.54 8.51,48.37 P1.4 7.48,51.04 13.59,57.15 v13.59,58.93 | v58.55,4.45 58.94,4.83 81.36,4.83 82.11,4.09 84.15,4.09 v85.34,5.28 | v85.34,7.92 SR6.12 | SR3.12 v32,93.55 | v13.59,61.47 13.59,90.68 16.89,93.98 28.07,93.98 v28.32,93.73 30.86,96.27 38.99,96.27 40.26,95 44.2,95 45.47,96.27 v58.8,96.27
VCC  (via drill 0.8)
  Top 0.3: v14.86,16.38 14.73,16.38 12.7,18.41 v12.7,18.92 | v18.67,90.68 v15.49,90.68 | v15.49,61.47 v15.49,58.93 | v16.13,40.51 v5.84,40.51
  Bottom 0.3: SR1.16 37.08,13.21 35.81,13.21 35.8,13.23 | 63.74,13.84 46.61,13.84 C2.1 45.97,12.57 42.9,9.5 41.33,7.93 37.24,7.93 35.8,9.38 35.8,13.23 | 63.74,13.84 65.02,13.84 67.56,11.3 SR2.16 | SR6.16 95.5,11.3 93.6,13.21 C6.1 73.91,11.68 70.04,7.81 65.06,7.81 63.74,9.13 63.74,13.84 | 35.8,13.23 35.18,13.84 19.18,13.84 18.92,13.59 C1.1 15.24,16.38 v14.86,16.38 | C5.1 94.23,85.72 92.46,87.5 83.78,87.5 81.55,89.74 81.55,91.84 80.82,92.57 79.64,92.57 79.63,92.58 78.36,92.58 77.72,91.95 SR5.16 77.09,90.04 73.28,90.04 C4.1 70.87,87.63 55.21,87.63 53.61,89.23 53.61,91.84 52.88,92.57 51.7,92.57 51.69,92.58 50.42,92.58 49.78,91.95 SR4.16 49.15,90.04 45.34,90.04 C3.1 23.11,88.14 21.21,90.04 SR3.16 v18.67,90.68 | P1.1 v5.84,40.51 5.84,38.86 6.6,38.1 6.6,36.45 5.84,35.69 5.84,28.83 5.21,28.19 5.21,26.42 v12.7,18.92 | v15.49,90.68 v15.49,61.47 | v15.49,58.93 17.4,57.02 17.4,41.78 v16.13,40.51